# EAGLE design G208B (EAGLE 6.6.0)
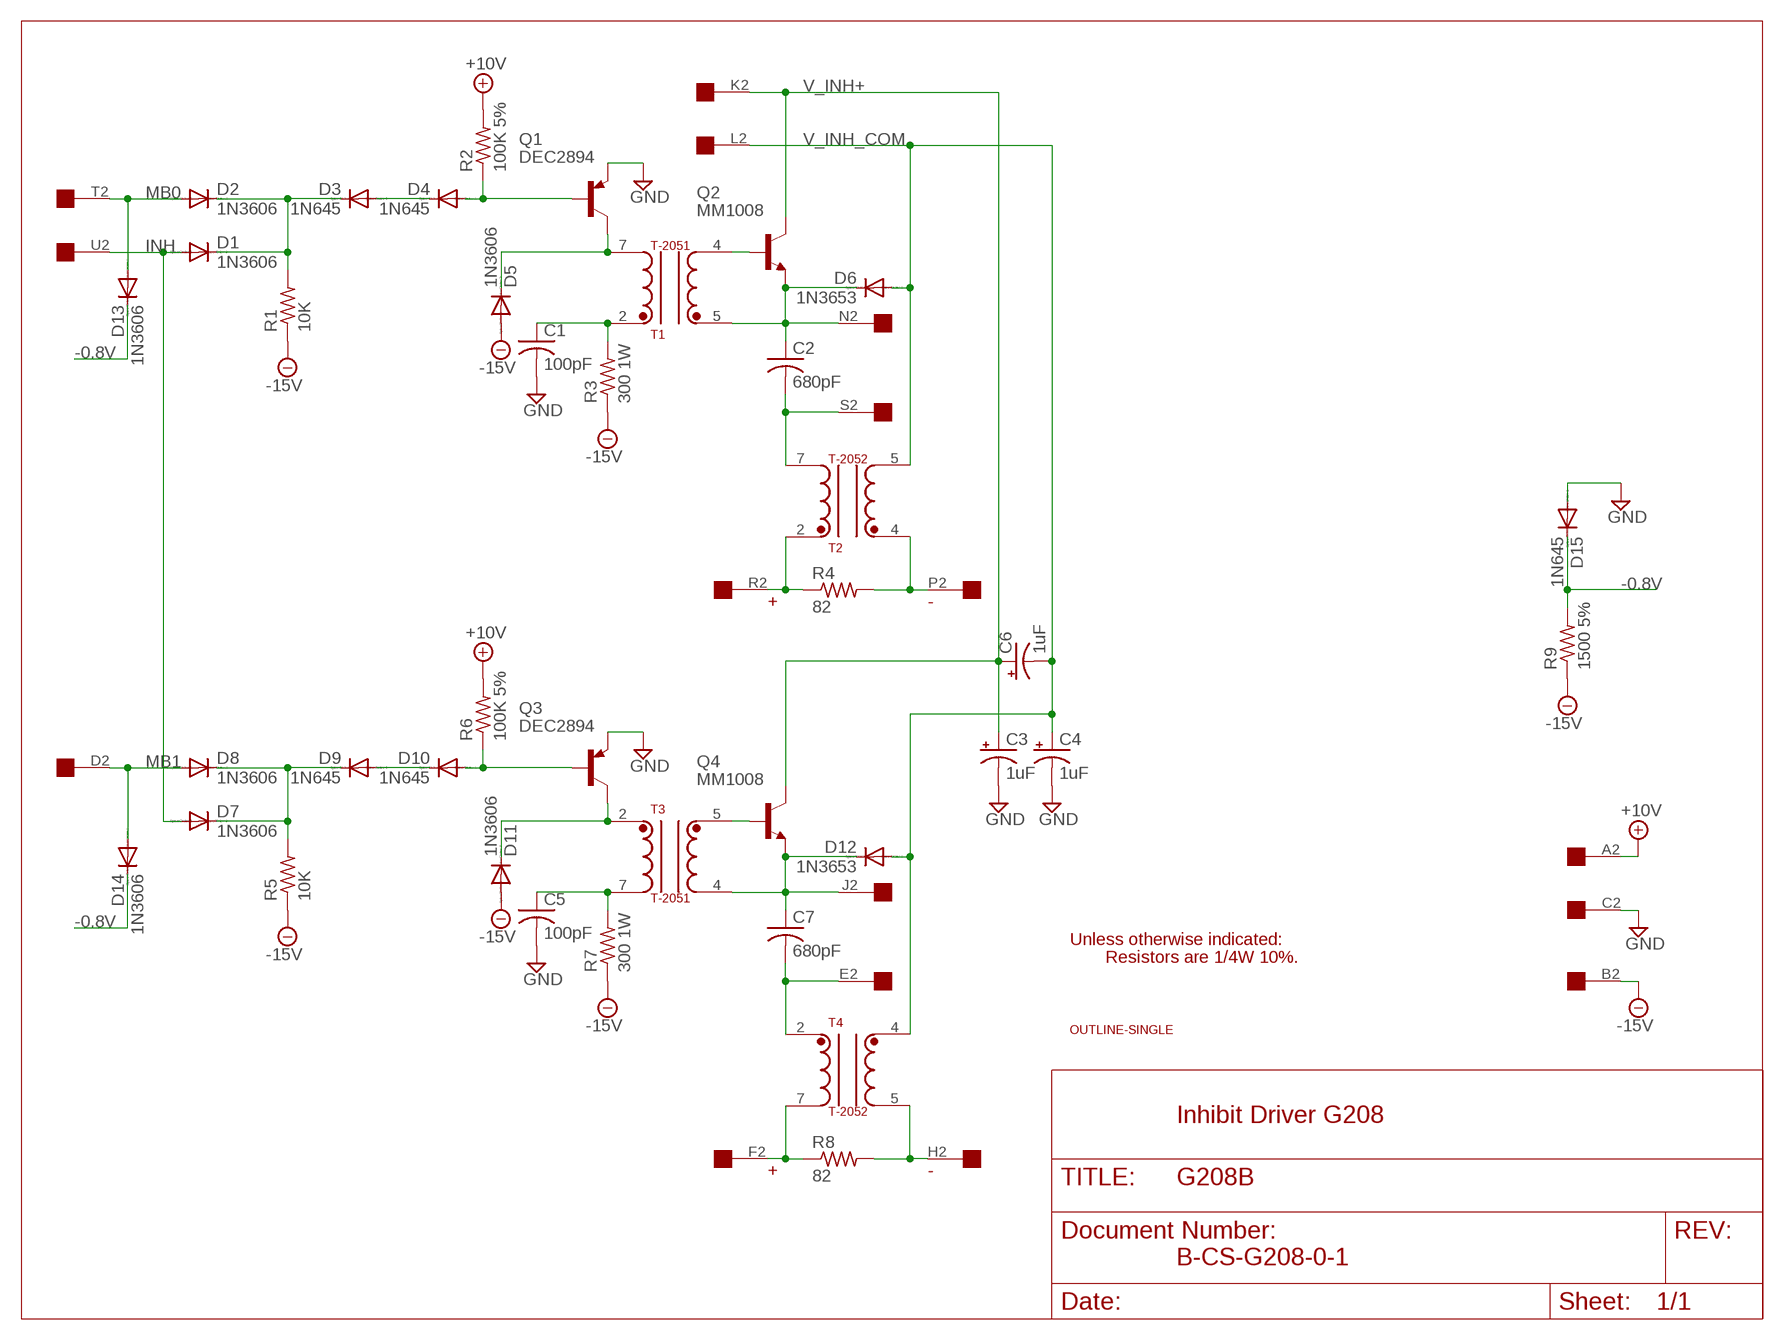
[diagram p0: schematic, sheet 1]

## Parts
C1  100pF  C-US075-032X103  [C075-032X103]
C2  680pF  C-US075-032X103  [C075-032X103]
C3  1uF  CPOL-USE25-9AXIAL  [E25-9]
C4  1uF  CPOL-USE25-9AXIAL  [E25-9]
C5  100pF  C-US075-032X103  [C075-032X103]
C6  1uF  CPOL-USE25-9AXIAL  [E25-9]
C7  680pF  C-US075-032X103  [C075-032X103]
D1  1N3606  1N4148DO35-10  [DO35-10]
D2  1N3606  1N4148DO35-10  [DO35-10]
D3  1N645  1N4148DO35-10  [DO35-10]
D4  1N645  1N4148DO35-10  [DO35-10]
D5  1N3606  1N4148DO35-10  [DO35-10]
D6  1N3653  1N4148DO35-10  [DO35-10]
D7  1N3606  1N4148DO35-10  [DO35-10]
D8  1N3606  1N4148DO35-10  [DO35-10]
D9  1N645  1N4148DO35-10  [DO35-10]
D10  1N645  1N4148DO35-10  [DO35-10]
D11  1N3606  1N4148DO35-10  [DO35-10]
D12  1N3653  1N4148DO35-10  [DO35-10]
D13  1N3606  1N4148DO35-10  [DO35-10]
D14  1N3606  1N4148DO35-10  [DO35-10]
D15  1N645  1N4148DO35-10  [DO35-10]
Q1  DEC2894  2N2904  [TO39]
Q2  MM1008  2N2102  [TO5]
Q3  DEC2894  2N2904  [TO39]
Q4  MM1008  2N2102  [TO5]
R1  10K  R-US_0207/10  [0207/10]
R2  100K 5%  R-US_0207/10  [0207/10]
R3  300 1W  R-US_0617/22  [0617/22]
R4  82  R-US_0207/10  [0207/10]
R5  10K  R-US_0207/10  [0207/10]
R6  100K 5%  R-US_0207/10  [0207/10]
R7  300 1W  R-US_0617/22  [0617/22]
R8  82  R-US_0207/10  [0207/10]
R9  1500 5%  R-US_0207/10  [0207/10]
T1  T-2051  [TRANSFORMER]
T2  T-2052  [TRANSFORMER]
T3  T-2051  [TRANSFORMER]
T4  T-2052  [TRANSFORMER]
U$1  OUTLINE-SINGLE  [SINGLE]
U$2  EDGE-1  [EDGE-CON1]

## Nets
+10V: R2.2 R6.2 U$2.A2
-0.8V: D13.C D14.C D15.C R9.2
-15V: D5.A D11.A R1.1 R3.1 R5.1 R7.1 R9.1 U$2.B2
GND [Supply]: C1.2 C3.- C4.- C5.2 D15.A Q1.1(E) Q3.1(E) U$2.C2
INH: D1.A D7.A U$2.U2
MB0: D2.A D13.A U$2.T2
MB1: D8.A D14.A U$2.D2
N$1: D1.C D2.C D3.C R1.2
N$2: D3.A D4.C
N$5: D4.A Q1.2(B) R2.1
N$6: D5.C Q1.3(C) T1.7
N$7: C1.1 R3.2 T1.2
N$8: Q2.2(B) T1.4
N$9: C2.1 D6.C Q2.1(E) T1.5 U$2.N2
N$10: R4.1 T2.2 U$2.R2
N$11: C2.2 T2.7 U$2.S2
N$12: R4.2 T2.4 U$2.P2
N$15: D7.C D8.C D9.C R5.2
N$16: D9.A D10.C
N$19: D10.A Q3.2(B) R6.1
N$20: D11.C Q3.3(C) T3.2
N$21: C5.1 R7.2 T3.7
N$22: Q4.2(B) T3.5
N$23: C7.1 D12.C Q4.1(E) T3.4 U$2.J2
N$24: C7.2 T4.2 U$2.E2
N$25: R8.1 T4.7 U$2.F2
N$26: R8.2 T4.5 U$2.H2
V_INH+: C3.+ C6.+ Q2.3(C) Q4.3(C) U$2.K2
V_INH_COM: C4.+ C6.- D6.A D12.A T2.5 T4.4 U$2.L2
Unconnected: U$2.M2 U$2.V2

## Notes on the sheet
- + | -
- Unless otherwise indicated:
- Resistors are 1/4W 10%.
- Inhibit Driver G208
- + | -
- B-CS-G208-0-1

## Library data of the parts
C1 C2 C5 C7 = rcl:C-US: CAPACITOR, American symbol
C3 C4 C6 = rcl:CPOL-US: POLARIZED CAPACITOR, American symbol
D1-D15 = diode:1N4148: DIODE high speed (Philips)
Q1 Q3 = transistor-pnp:2N2904*: PNP Transistror
Q2 Q4 = transistor:2N2102: NPN TRANSISTOR
R1-R9 = rcl:R-US_: RESISTOR, American symbol
T1 T3 = dec-con:T-2051: T-2052 Transformer
T2 T4 = dec-con:T-2052: T-2052 Transformer
U$1 = dec-con:OUTLINE-*: Board outlines for DEC boards.
U$2 = dec-con:EDGE-1: Single-Sided DEC Edge Connector -- (side 2)

## Net classes
1 Supply: width 0.813 mm

## Board
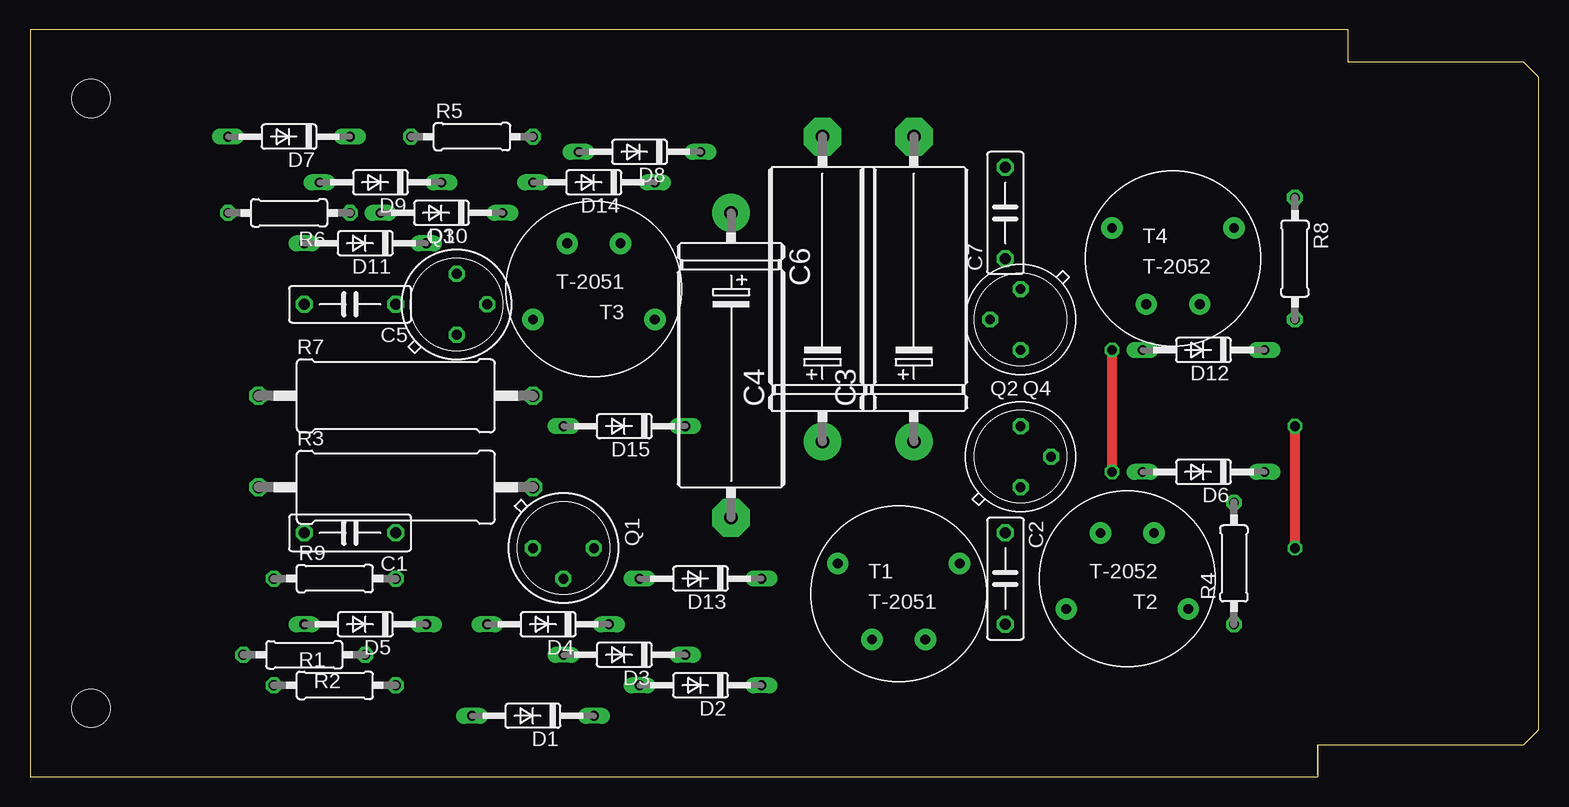
[diagram p1: board, top side]
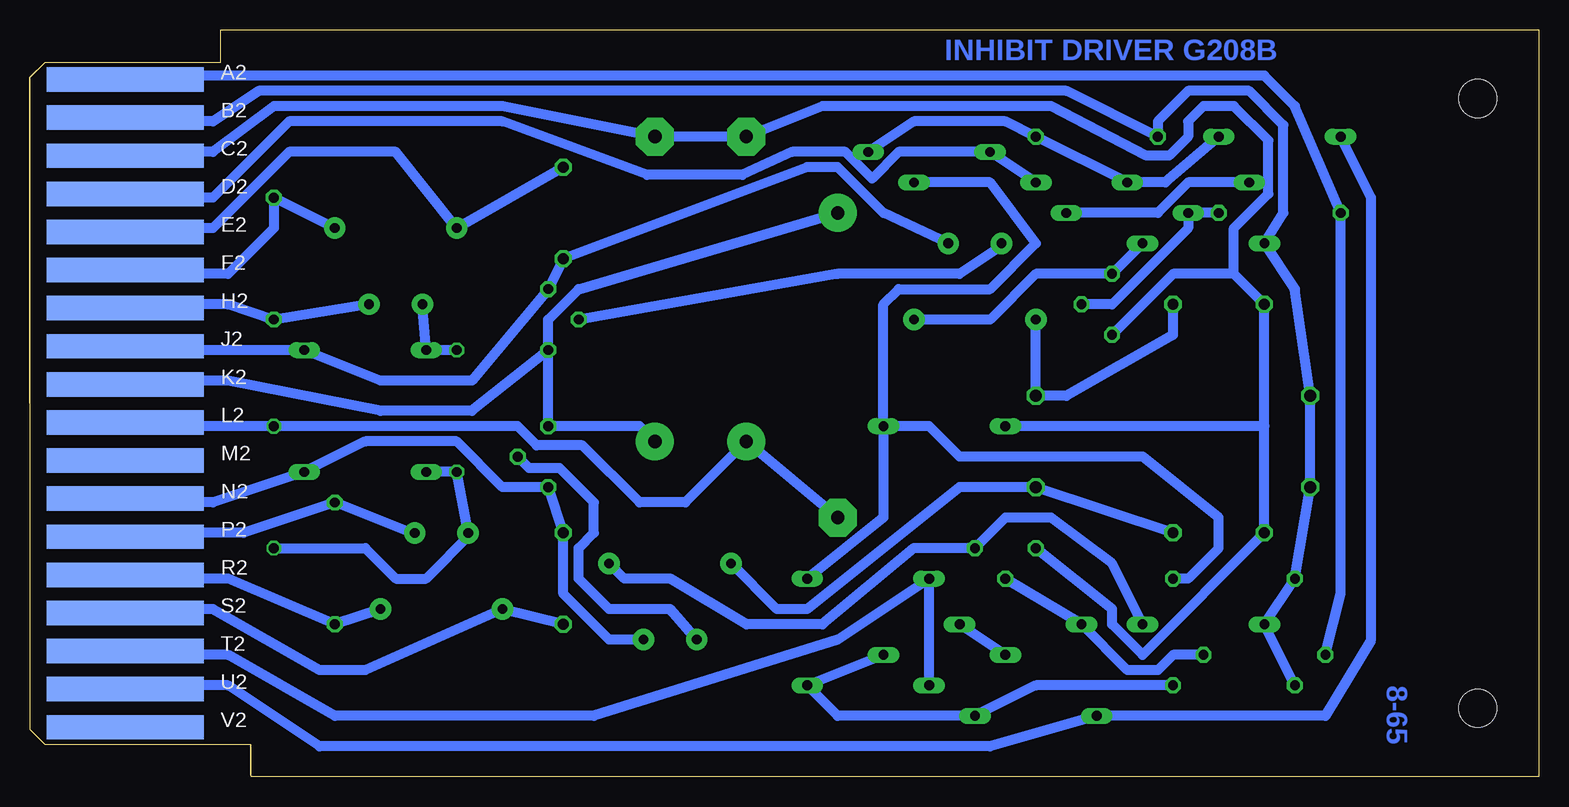
[diagram p2: board, bottom side, seen from below]

Size 125.73 x 62.23 mm. Coordinates in mm from the lower left corner, seen from the top.
Copper layers (1+16): Top 0.035mm / dielectric 1.5mm / Bottom 0.035mm
Design rules "16mils": minimum track width 16mil, minimum drill 32mil, track to track 15mil, track to pad 10mil, pad to pad 10mil, via to via 10mil, smd to smd 10mil, copper to edge 13mil, drill to drill 10mil, minimum pad ring 10mil, minimum via ring 8mil, stop-mask expansion 0mil, vias tented up to drill 0mil, thermal gap 10mil

### Footprints (pad centres in the part's own frame; a part is rotated, then mirrored left to right if it is on the bottom)
C075-032X103 = drill 0.914 octagon: 1 -3.81,0; 2 3.81,0
E25-9 = drill 1.118 pad 3.15: + -12.7,0 | drill 1.118 pad 3.15 octagon: - 12.7,0
DO35-10 = drill 0.813 long: A 5.08,0; C -5.08,0
TO39 = drill 0.813 octagon: 1 0,-2.54; 2 2.54,0; 3 0,2.54
TO5 = drill 0.813 octagon: 1 0,-2.54; 2 2.54,0; 3 0,2.54
0207/10 = drill 0.813 octagon: 1 -5.08,0; 2 5.08,0
0617/22 = drill 1.016 octagon: 1 -11.43,0; 2 11.43,0
TRANSFORMER = drill 0.813 pad 1.778: 2 -5.08,2.54; 4 -2.223,-3.81; 5 2.223,-3.81; 7 5.08,2.54
SINGLE = hole 3.175: 120.65,56.515; 120.65,5.715
EDGE-CON1 = smd 13.106 x 2.032 bottom: A2 7.938,4.128; B2 7.938,7.303; C2 7.938,10.477; D2 7.938,13.652; E2 7.938,16.828; F2 7.938,20.003; H2 7.938,23.177; J2 7.938,26.352; K2 7.938,29.527; L2 7.938,32.703; M2 7.938,35.877; N2 7.938,39.053; P2 7.938,42.227; R2 7.938,45.403; S2 7.938,48.578; T2 7.938,51.752; U2 7.938,54.928; V2 7.938,58.102

### Placement (x,y rotation side)
C1  26.67,20.32 180 top
C2  81.28,16.51 270 top
C3  73.66,40.64 90 top
C4  66.04,40.64 90 top
C5  26.67,39.37 180 top
C6  58.42,34.29 270 top
C7  81.28,46.99 90 top
D1  41.91,5.08 180 top
D2  55.88,7.62 180 top
D3  49.53,10.16 180 top
D4  43.18,12.7 180 top
D5  27.94,12.7 180 top
D6  97.79,25.4 180 top
D7  21.59,53.34 180 top
D8  50.8,52.07 180 top
D9  29.21,49.53 180 top
D10  34.29,46.99 180 top
D11  27.94,44.45 180 top
D12  97.79,35.56 180 top
D13  55.88,16.51 180 top
D14  46.99,49.53 180 top
D15  49.53,29.21 180 top
Q1  44.45,19.05 270 top
Q2  82.55,26.67 0 top
Q3  35.56,39.37 0 top
Q4  82.55,38.1 180 top
R1  25.4,7.62 0 top
R2  22.86,10.16 180 top
R3  30.48,24.13 0 top
R4  100.33,17.78 90 top
R5  36.83,53.34 0 top
R6  21.59,46.99 180 top
R7  30.48,31.75 0 top
R8  105.41,43.18 270 top
R9  25.4,16.51 0 top
T1  72.39,15.24 0 top
T2  91.44,16.51 180 top
T3  46.99,40.64 180 top
T4  95.25,43.18 0 top
U$1  125.73,62.23 180 top
U$2  125.73,62.23 180 top

### Tracks (layer width: path | path; a pad name or v marks a point on that pad's centre or on a via)
+10V
  Bottom 0.813: U$2.A2 116.84,58.42 22.86,58.42 20.32,55.88 R6.2 16.51,15.24 R2.2
-0.8V
  Bottom 0.813: R9.2 29.21,16.51 26.67,19.05 26.67,21.59 33.02,26.67 48.26,26.67 50.8,29.21 D15.C | D13.C 54.61,21.59 D15.C | D14.C 45.72,49.53 41.91,44.45 45.72,40.64 53.34,40.64 54.61,39.37 D15.C
-15V
  Bottom 0.813: R1.1 D5.A R9.1 R3.1 R7.1 20.32,40.64 D11.A 21.27,46.99 21.27,54.29 24.13,57.15 29.21,57.15 31.75,54.61 R5.1 39.37,57.15 106.68,57.15 110.49,54.61 116.84,54.61 U$2.B2
GND
  Bottom 0.813: 22.86,29.21 C1.2 33.02,10.16 35.56,12.7 35.56,13.97 Q1.1 | 22.86,29.21 C5.2 25.4,41.91 | 25.4,41.91 30.48,41.91 Q3.1 | 25.4,41.91 25.4,45.72 22.54,48.58 22.54,53.02 25.4,55.88 27.94,55.88 29.21,54.61 29.21,53.34 30.8,51.75 32.7,51.75 40.64,55.88 59.69,55.88 C4.- C3.- 86.36,55.88 105.41,55.88 110.49,52.07 116.84,52.07 U$2.C2 | 22.86,29.21 D15.A
INH
  Bottom 0.813: U$2.U2 116.84,7.62 109.22,7.62 101.6,2.54 45.72,2.54 D1.A 17.78,5.08 13.97,11.43 13.97,48.26 D7.A
MB0
  Bottom 0.813: U$2.T2 116.84,10.16 109.22,10.16 100.33,5.08 78.74,5.08 58.42,11.43 D13.A D2.A
MB1
  Bottom 0.813: D14.A D8.A 53.34,52.07 55.56,49.85 57.78,52.07 62.23,52.07 66.36,50.16 74.3,50.16 86.36,54.61 104.14,54.61 110.49,48.26 115.57,48.26 U$2.D2
N$1
  Bottom 0.813: D3.C D2.C 58.42,5.08 D1.C 41.91,7.62 R1.2
N$2
  Bottom 0.813: D3.A D4.C
N$5
  Bottom 0.813: R2.1 30.48,10.16 31.75,8.89 34.29,8.89 D4.A Q1.2
N$6
  Bottom 0.813: T1.7 76.2,16.51 72.39,16.51 66.04,12.7 59.69,12.7 52.07,19.05 Q1.3 44.45,21.59 40.64,21.59 35.56,17.78 D5.C
N$7
  Bottom 0.813: C1.1 R3.2 48.26,24.13 60.96,13.97 63.5,13.97 T1.2
N$8
  Bottom 0.813: Q2.2 84.14,25.72 81.6,25.72 78.74,22.86 78.74,20.32 80.01,19.05 80.01,16.51 77.47,13.97 72.39,13.97 T1.4
N$9
  Bottom 0.813: U$2.N2 116.84,22.86 110.49,22.86 D6.C 97.79,27.94 90.17,27.94 86.36,24.13 Q2.1 C2.1 81.28,15.24 77.47,11.43 T1.5
N$10
  Bottom 0.813: U$2.R2 115.9,16.84 115.57,16.51 109.22,16.51 R4.1 T2.2
N$11
  Bottom 0.813: U$2.S2 116.84,13.97 110.49,13.97 101.6,8.89 97.79,8.89 T2.7 C2.2
N$12
  Bottom 0.813: U$2.P2 117.17,19.99 116.84,20.32 107.95,20.32 R4.2 93.98,20.32 T2.4
N$15
  Bottom 0.813: D7.C 31.11,49.53 D9.C R5.2 44.45,54.61 52.07,54.61 D8.C
N$16
  Bottom 0.813: D9.A 29.21,49.53 31.75,46.99 D10.C
N$19
  Bottom 0.813: Q3.2 35.56,39.37 29.21,45.72 D10.A R6.1
N$20
  Bottom 0.813: T3.2 45.72,38.1 41.91,41.91 Q3.3 D11.C
N$21
  Bottom 0.813: C5.1 30.48,36.83 39.37,31.75 R7.2 T3.7
N$22
  Bottom 0.813: Q4.2 58.42,41.91 48.26,41.91 44.45,44.45 T3.5
N$23
  Bottom 0.813: U$2.J2 116.84,35.56 D12.C 96.52,33.02 88.9,33.02 Q4.1 C7.1 60.96,50.8 58.42,50.8 54.61,46.99 T3.4
N$24
  Bottom 0.813: C7.2 T4.2 95.25,52.07 104.14,52.07 110.49,45.72 116.84,45.72 U$2.E2
N$25
  Bottom 0.813: U$2.F2 116.84,41.91 109.22,41.91 105.41,45.72 R8.1 T4.7
N$26
  Bottom 0.813: U$2.H2 116.84,39.37 109.22,39.37 R8.2 T4.5
V_INH+
  Bottom 0.813: C3.+ 74.93,29.21 Q2.3 Q4.3 | U$2.K2 116.84,33.02 109.22,33.02 96.52,30.48 88.9,30.48 Q4.3 | C6.+ 80.01,40.64 82.55,38.1 Q4.3
V_INH_COM  (via drill 0.81)
  Top 0.813: v105.41,29.21 v105.41,19.05 | v90.17,25.4 v90.17,35.56
  Bottom 0.813: U$2.L2 117.17,29.54 116.84,29.21 v105.41,29.21 85.09,29.21 83.5,27.62 79.69,27.62 74.93,22.86 71.12,22.86 C4.+ C6.- | v105.41,19.05 97.79,19.05 95.25,16.51 92.71,16.51 88.9,20.32 T2.5 v90.17,25.4 D6.A | v90.17,35.56 D12.A T4.4

### Text on the board
Bottom: INHIBIT DRIVER G208B | 8-65